# EAGLE schematic RADAR (EAGLE 7.4.0), part 2 of 2
## Sheet 3 of 3: RF
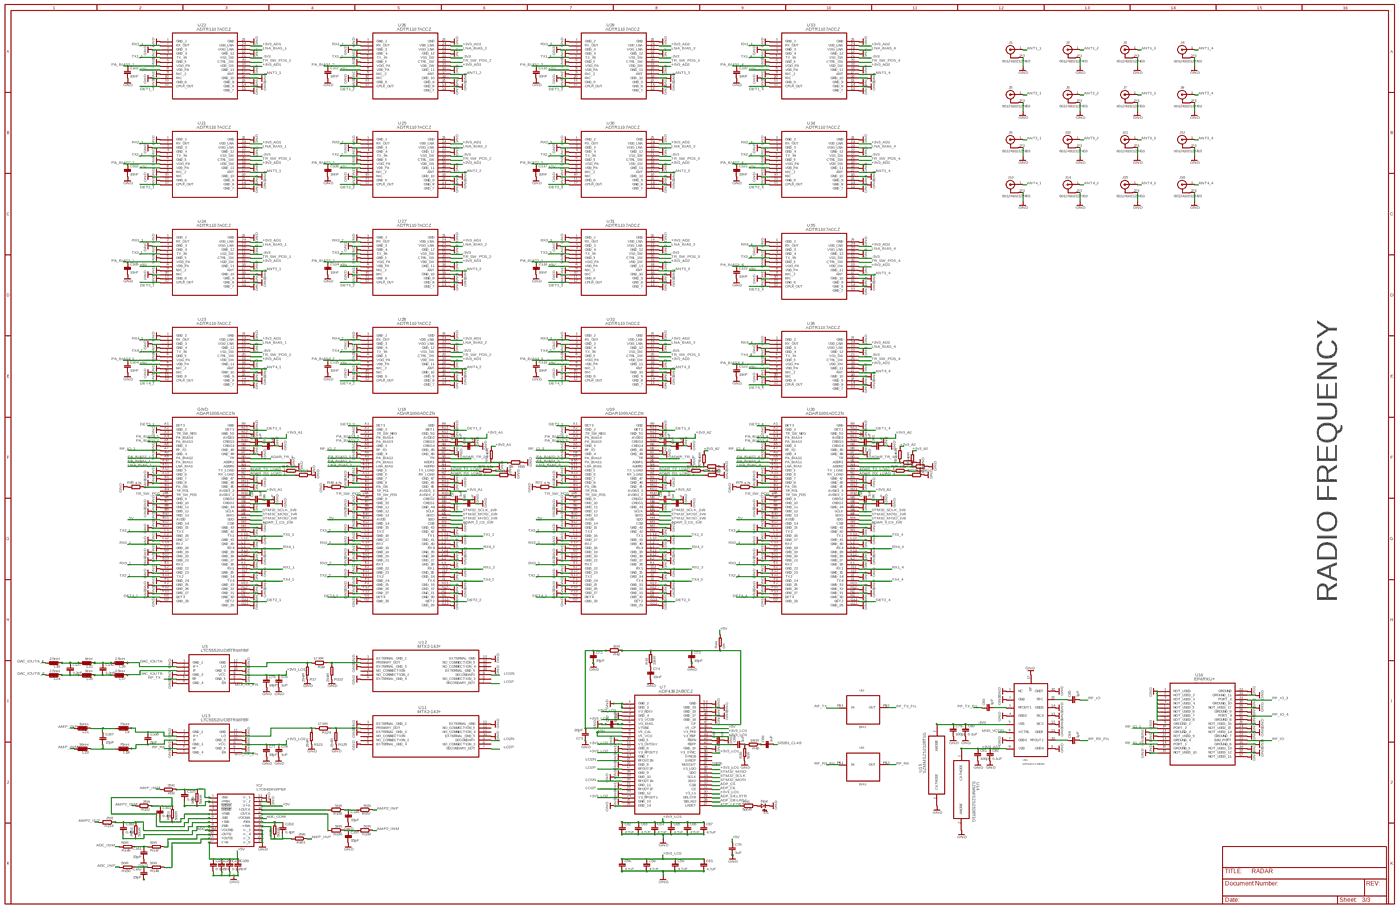
[diagram p6: schematic, sheet 3, overview]
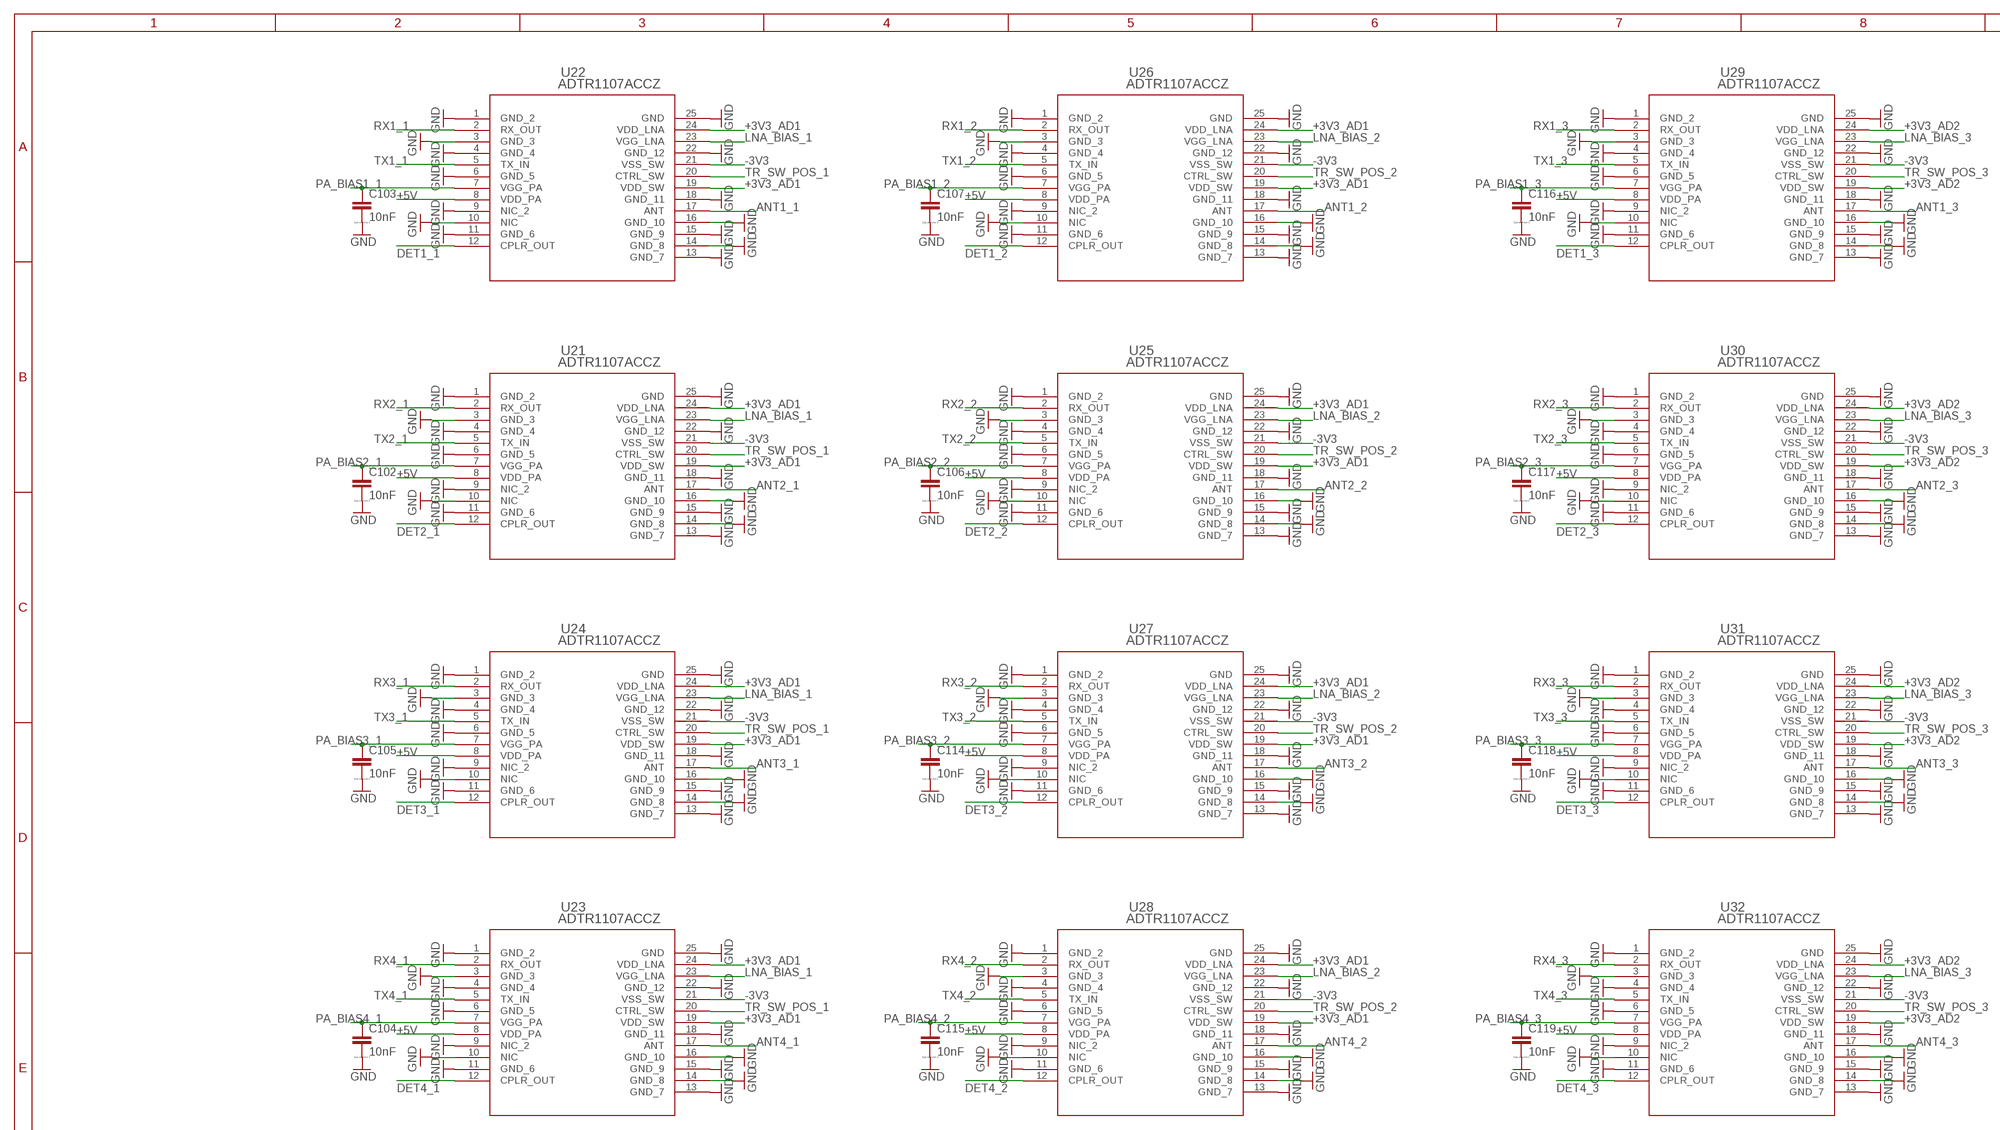
[diagram p7: schematic, sheet 3, part 1 of 4]
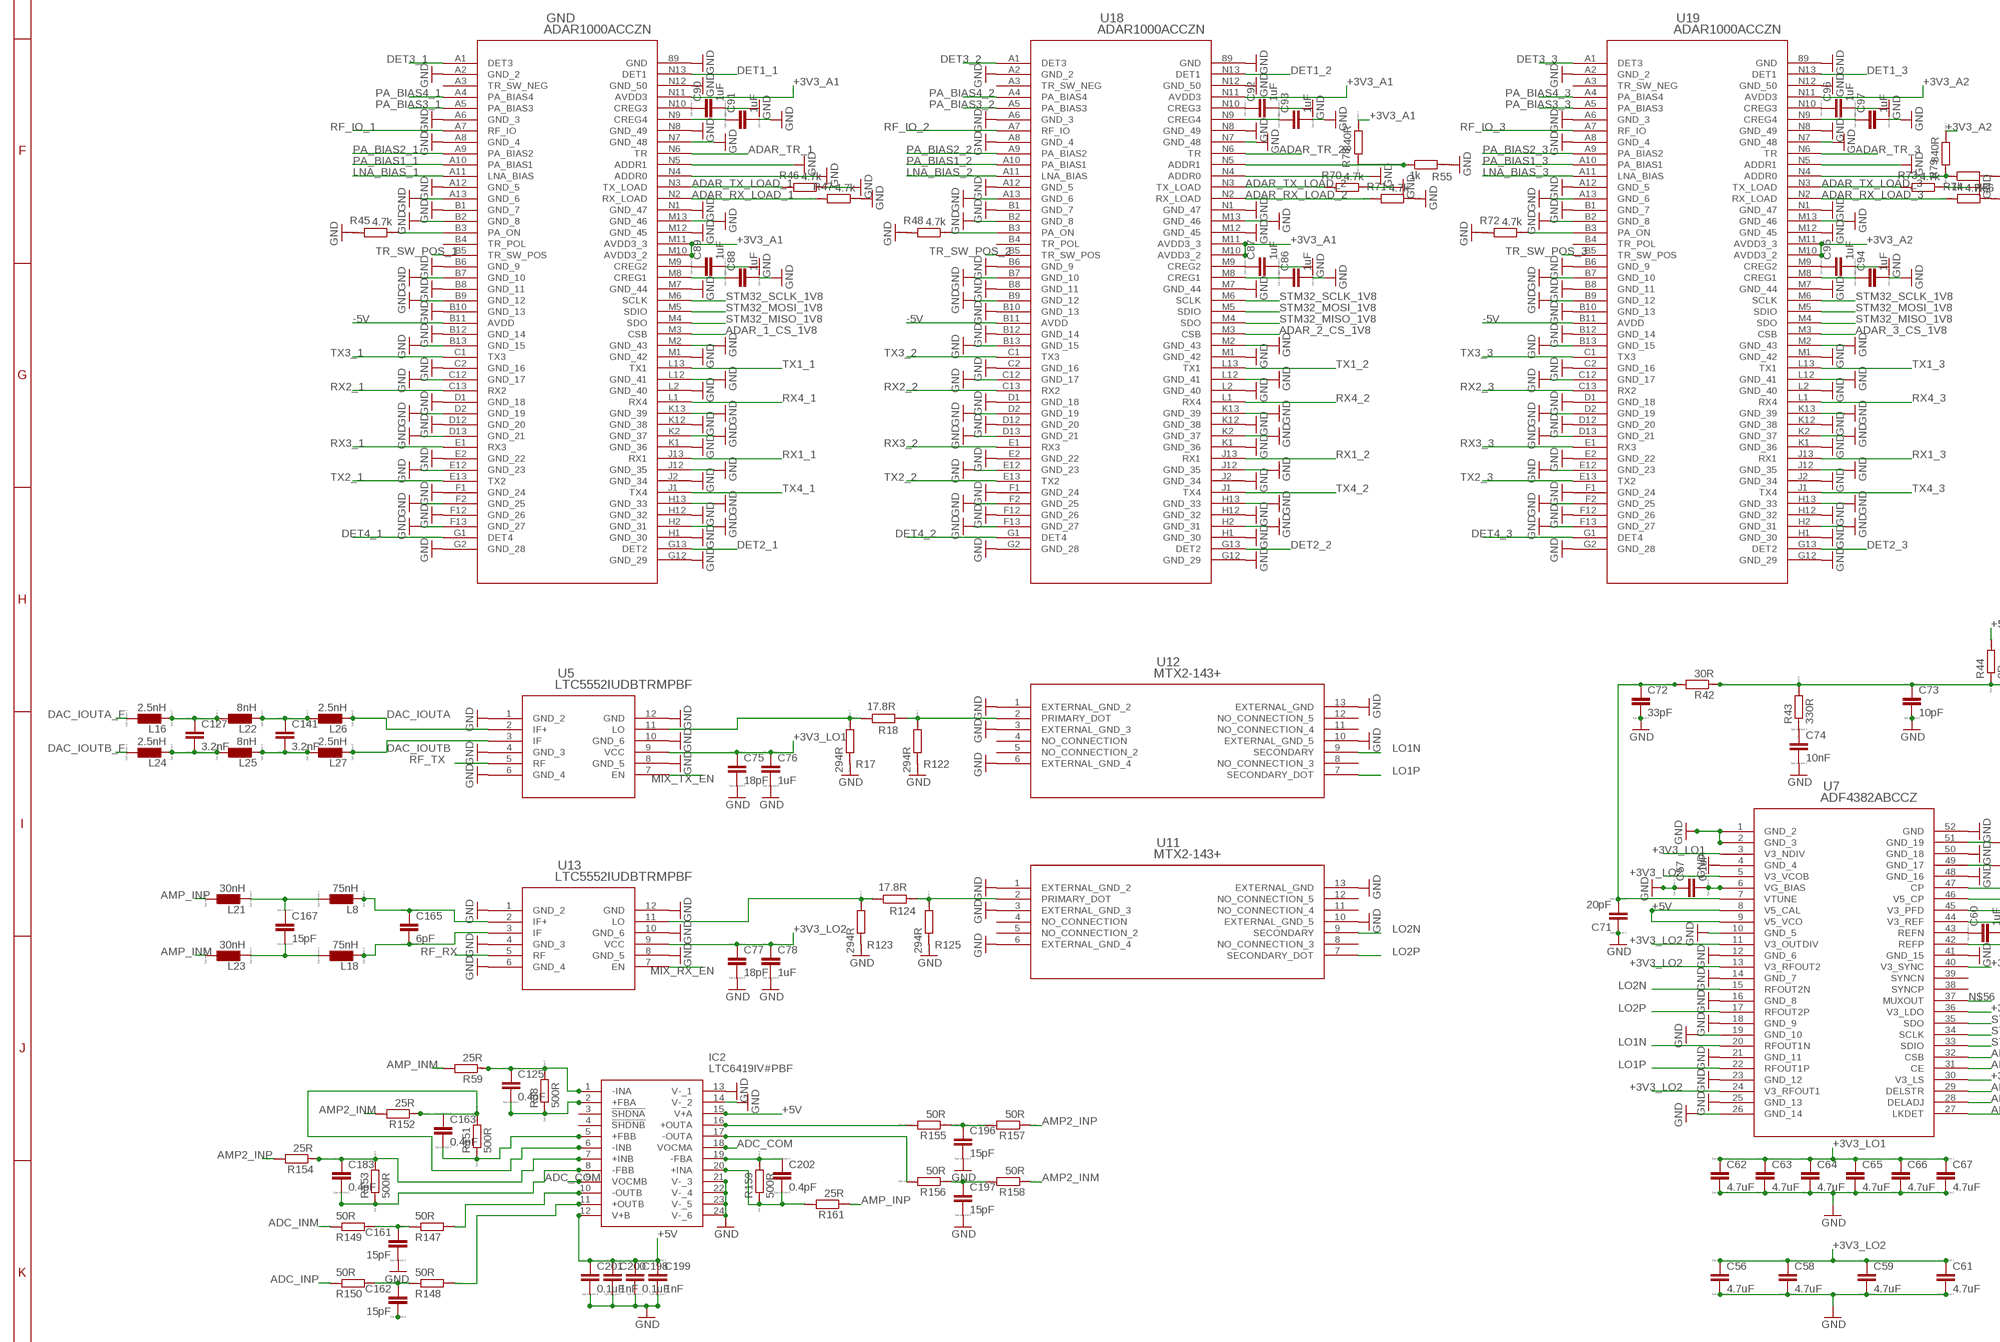
[diagram p8: schematic, sheet 3, part 2 of 4]
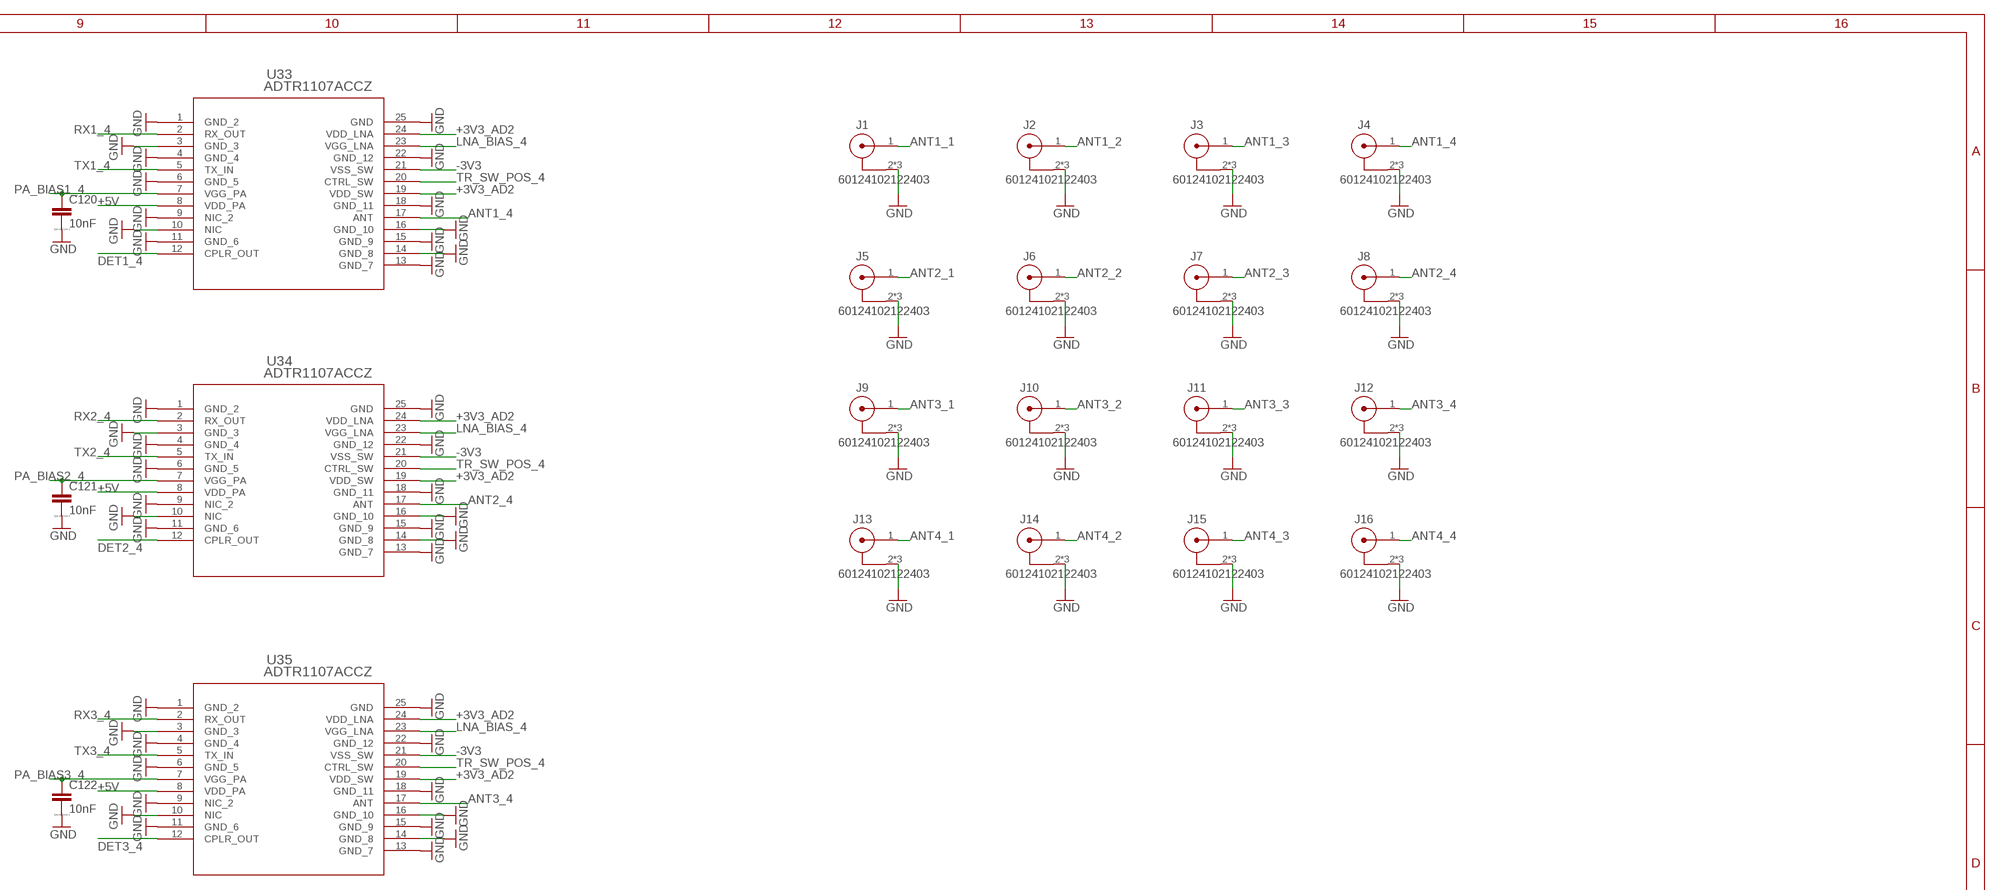
[diagram p9: schematic, sheet 3, part 3 of 4]
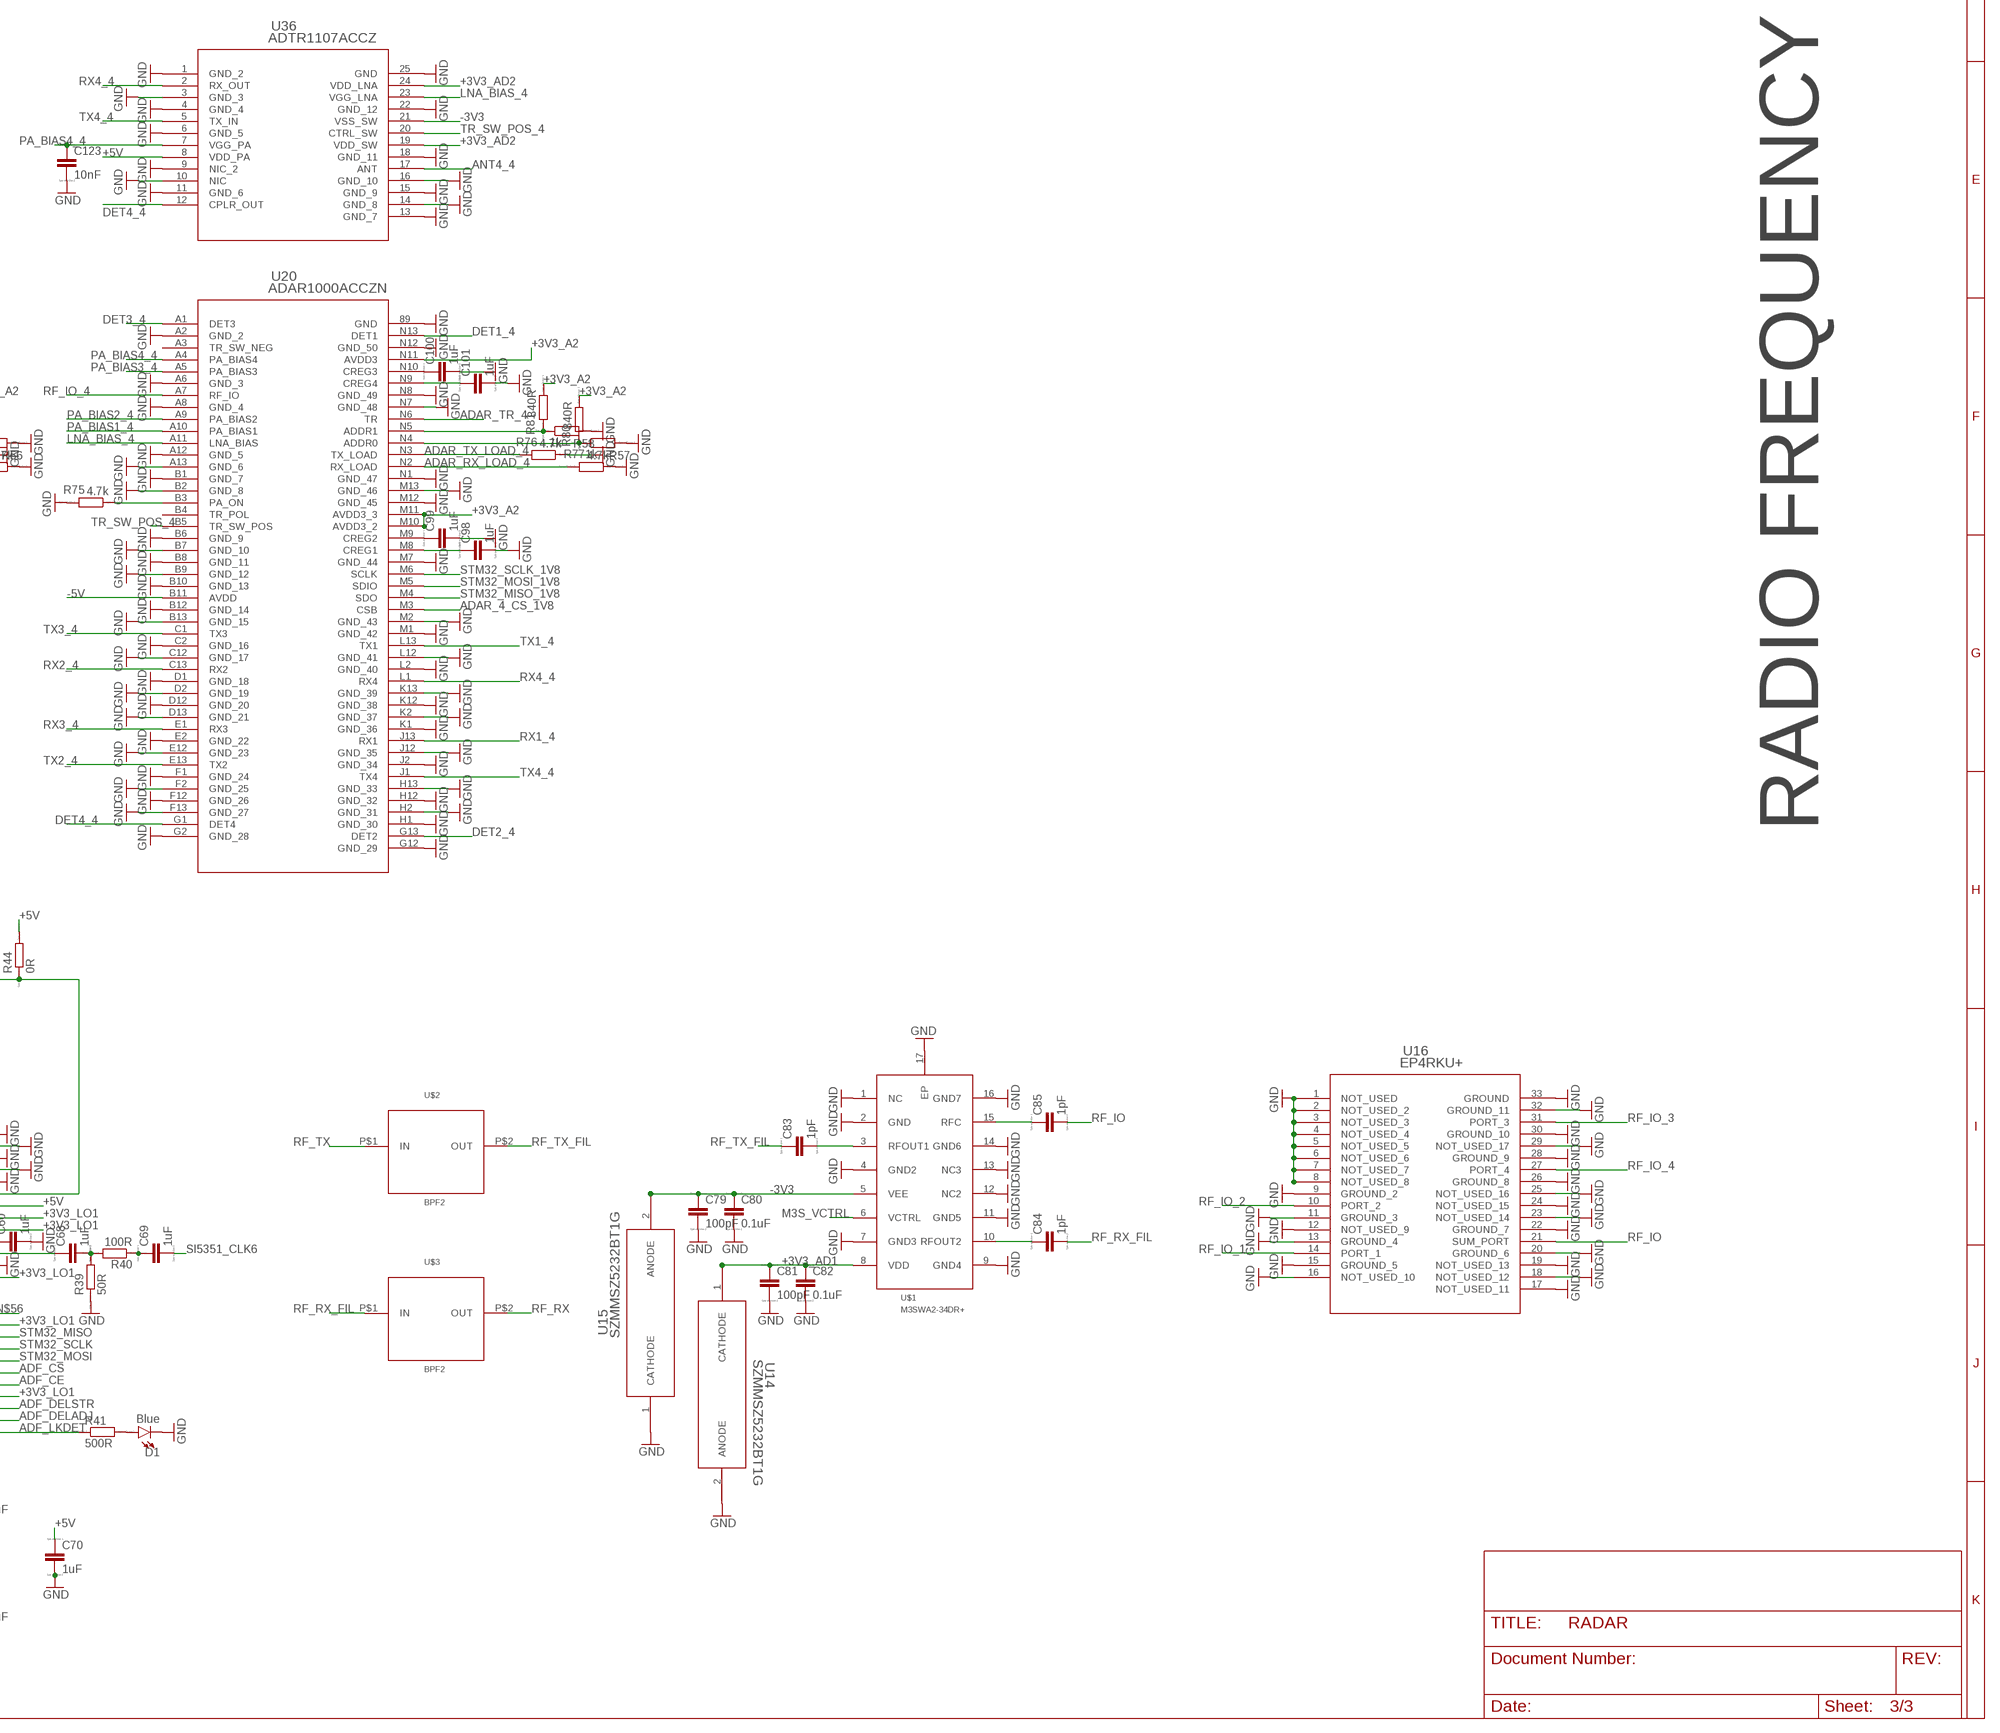
[diagram p10: schematic, sheet 3, part 4 of 4]

### Parts
C56  4.7uF  CC0201  [C0201]
C57  0.1uF  CC0201  [C0201]
C58  4.7uF  CC0201  [C0201]
C59  4.7uF  CC0201  [C0201]
C60  1uF  CC0201  [C0201]
C61  4.7uF  CC0201  [C0201]
C62  4.7uF  CC0201  [C0201]
C63  4.7uF  CC0201  [C0201]
C64  4.7uF  CC0201  [C0201]
C65  4.7uF  CC0201  [C0201]
C66  4.7uF  CC0201  [C0201]
C67  4.7uF  CC0201  [C0201]
C68  1uF  CC0201  [C0201]
C69  1uF  CC0201  [C0201]
C70  1uF  CC0201  [C0201]
C71  20pF  CC0201  [C0201]
C72  33pF  CC0201  [C0201]
C73  10pF  CC0201  [C0201]
C74  10nF  CC0201  [C0201]
C75  18pF  CC0201  [C0201]
C76  1uF  CC0201  [C0201]
C77  18pF  CC0201  [C0201]
C78  1uF  CC0201  [C0201]
C79  100pF  CC0201  [C0201]
C80  0.1uF  CC0201  [C0201]
C81  100pF  CC0201  [C0201]
C82  0.1uF  CC0201  [C0201]
C83  1pF  CC0201  [C0201]
C84  1pF  CC0201  [C0201]
C85  1pF  CC0201  [C0201]
C86  1uF  CC0201  [C0201]
C87  1uF  CC0201  [C0201]
C88  1uF  CC0201  [C0201]
C89  1uF  CC0201  [C0201]
C90  1uF  CC0201  [C0201]
C91  1uF  CC0201  [C0201]
C92  1uF  CC0201  [C0201]
C93  1uF  CC0201  [C0201]
C94  1uF  CC0201  [C0201]
C95  1uF  CC0201  [C0201]
C96  1uF  CC0201  [C0201]
C97  1uF  CC0201  [C0201]
C98  1uF  CC0201  [C0201]
C99  1uF  CC0201  [C0201]
C100  1uF  CC0201  [C0201]
C101  1uF  CC0201  [C0201]
C102  10nF  CC0201  [C0201]
C103  10nF  CC0201  [C0201]
C104  10nF  CC0201  [C0201]
C105  10nF  CC0201  [C0201]
C106  10nF  CC0201  [C0201]
C107  10nF  CC0201  [C0201]
C114  10nF  CC0201  [C0201]
C115  10nF  CC0201  [C0201]
C116  10nF  CC0201  [C0201]
C117  10nF  CC0201  [C0201]
C118  10nF  CC0201  [C0201]
C119  10nF  CC0201  [C0201]
C120  10nF  CC0201  [C0201]
C121  10nF  CC0201  [C0201]
C122  10nF  CC0201  [C0201]
C123  10nF  CC0201  [C0201]
C125  0.4pF  CC0201  [C0201]
C127  3.2nF  CC0201  [C0201]
C141  3.2nF  CC0201  [C0201]
C161  15pF  CC0201  [C0201]
C162  15pF  CC0201  [C0201]
C163  0.4pF  CC0201  [C0201]
C165  6pF  CC0201  [C0201]
C167  15pF  CC0201  [C0201]
C183  0.4pF  CC0201  [C0201]
C196  15pF  CC0201  [C0201]
C197  15pF  CC0201  [C0201]
C198  0.1uF  CC0201  [C0201]
C199  1nF  CC0201  [C0201]
C200  1nF  CC0201  [C0201]
C201  0.1uF  CC0201  [C0201]
C202  0.4pF  CC0201  [C0201]
D1  Blue  LED-BLUE0603  [LED-0603]
GND  ADAR1000ACCZN  [CC-88-1_ADI]
IC2  LTC6419IV#PBF  [LTC6419IVPBF]
J1  60124102122403  [60124102122403]
J2  60124102122403  [60124102122403]
J3  60124102122403  [60124102122403]
J4  60124102122403  [60124102122403]
J5  60124102122403  [60124102122403]
J6  60124102122403  [60124102122403]
J7  60124102122403  [60124102122403]
J8  60124102122403  [60124102122403]
J9  60124102122403  [60124102122403]
J10  60124102122403  [60124102122403]
J11  60124102122403  [60124102122403]
J12  60124102122403  [60124102122403]
J13  60124102122403  [60124102122403]
J14  60124102122403  [60124102122403]
J15  60124102122403  [60124102122403]
J16  60124102122403  [60124102122403]
L8  75nH  LL0201  [L0201]
L16  2.5nH  LL0201  [L0201]
L18  75nH  LL0201  [L0201]
L21  30nH  LL0201  [L0201]
L22  8nH  LL0201  [L0201]
L23  30nH  LL0201  [L0201]
L24  2.5nH  LL0201  [L0201]
L25  8nH  LL0201  [L0201]
L26  2.5nH  LL0201  [L0201]
L27  2.5nH  LL0201  [L0201]
R17  294R  RR0201  [R0201]
R18  17.8R  RR0201  [R0201]
R38  500R  RR0201  [R0201]
R39  50R  RR0201  [R0201]
R40  100R  RR0201  [R0201]
R41  500R  RR0201  [R0201]
R42  30R  RR0201  [R0201]
R43  330R  RR0201  [R0201]
R44  0R  RR0201  [R0201]
R45  4.7k  RR0201  [R0201]
R46  4.7k  RR0201  [R0201]
R47  4.7k  RR0201  [R0201]
R48  4.7k  RR0201  [R0201]
R55  1k  RR0201  [R0201]
R56  1k  RR0201  [R0201]
R57  1k  RR0201  [R0201]
R58  1k  RR0201  [R0201]
R59  25R  RR0201  [R0201]
R70  4.7k  RR0201  [R0201]
R71  4.7k  RR0201  [R0201]
R72  4.7k  RR0201  [R0201]
R73  4.7k  RR0201  [R0201]
R74  4.7k  RR0201  [R0201]
R75  4.7k  RR0201  [R0201]
R76  4.7k  RR0201  [R0201]
R77  4.7k  RR0201  [R0201]
R78  840R  RR0201  [R0201]
R79  840R  RR0201  [R0201]
R80  840R  RR0201  [R0201]
R81  840R  RR0201  [R0201]
R122  294R  RR0201  [R0201]
R123  294R  RR0201  [R0201]
R124  17.8R  RR0201  [R0201]
R125  294R  RR0201  [R0201]
R147  50R  RR0201  [R0201]
R148  50R  RR0201  [R0201]
R149  50R  RR0201  [R0201]
R150  50R  RR0201  [R0201]
R151  500R  RR0201  [R0201]
R152  25R  RR0201  [R0201]
R153  500R  RR0201  [R0201]
R154  25R  RR0201  [R0201]
R155  50R  RR0201  [R0201]
R156  50R  RR0201  [R0201]
R157  50R  RR0201  [R0201]
R158  50R  RR0201  [R0201]
R159  500R  RR0201  [R0201]
R161  25R  RR0201  [R0201]
U5  LTC5552IUDBTRMPBF  [UDB_12_ADI]
U7  ADF4382ABCCZ  [CC-48-10_ADI]
U11  MTX2-143+  [DQ1225_MNC]
U12  MTX2-143+  [DQ1225_MNC]
U13  LTC5552IUDBTRMPBF  [UDB_12_ADI]
U14  SZMMSZ5232BT1G  [SOD-123_ONS]
U15  SZMMSZ5232BT1G  [SOD-123_ONS]
U16  EP4RKU+  [DG1677-2_MNC]
U18  ADAR1000ACCZN  [CC-88-1_ADI]
U19  ADAR1000ACCZN  [CC-88-1_ADI]
U20  ADAR1000ACCZN  [CC-88-1_ADI]
U21  ADTR1107ACCZ  [CC-24-8_ADI]
U22  ADTR1107ACCZ  [CC-24-8_ADI]
U23  ADTR1107ACCZ  [CC-24-8_ADI]
U24  ADTR1107ACCZ  [CC-24-8_ADI]
U25  ADTR1107ACCZ  [CC-24-8_ADI]
U26  ADTR1107ACCZ  [CC-24-8_ADI]
U27  ADTR1107ACCZ  [CC-24-8_ADI]
U28  ADTR1107ACCZ  [CC-24-8_ADI]
U29  ADTR1107ACCZ  [CC-24-8_ADI]
U30  ADTR1107ACCZ  [CC-24-8_ADI]
U31  ADTR1107ACCZ  [CC-24-8_ADI]
U32  ADTR1107ACCZ  [CC-24-8_ADI]
U33  ADTR1107ACCZ  [CC-24-8_ADI]
U34  ADTR1107ACCZ  [CC-24-8_ADI]
U35  ADTR1107ACCZ  [CC-24-8_ADI]
U36  ADTR1107ACCZ  [CC-24-8_ADI]
U$1  M3SWA2-34DR+  [16_QFN]
U$2  BPF2  [BPF2]
U$3  BPF2  [BPF2]

### Nets
+3V3_A1: GND.M10(AVDD3_2) GND.M11(AVDD3_3) GND.N11(AVDD3) R78.1 U18.M10(AVDD3_2) U18.M11(AVDD3_3) U18.N11(AVDD3) ; also sheet 1
+3V3_A2: R79.1 R80.1 R81.1 U19.M10(AVDD3_2) U19.M11(AVDD3_3) U19.N11(AVDD3) U20.M10(AVDD3_2) U20.M11(AVDD3_3) U20.N11(AVDD3) ; also sheet 1
+3V3_AD1: C81.1 C82.1 U14.1(CATHODE) U21.19(VDD_SW) U21.24(VDD_LNA) U22.19(VDD_SW) U22.24(VDD_LNA) U23.19(VDD_SW) U23.24(VDD_LNA) U24.19(VDD_SW) U24.24(VDD_LNA) U25.19(VDD_SW) U25.24(VDD_LNA) U26.19(VDD_SW) U26.24(VDD_LNA) U27.19(VDD_SW) U27.24(VDD_LNA) U28.19(VDD_SW) U28.24(VDD_LNA) U$1.8(VDD) ; also sheet 1
+3V3_AD2: U29.19(VDD_SW) U29.24(VDD_LNA) U30.19(VDD_SW) U30.24(VDD_LNA) U31.19(VDD_SW) U31.24(VDD_LNA) U32.19(VDD_SW) U32.24(VDD_LNA) U33.19(VDD_SW) U33.24(VDD_LNA) U34.19(VDD_SW) U34.24(VDD_LNA) U35.19(VDD_SW) U35.24(VDD_LNA) U36.19(VDD_SW) U36.24(VDD_LNA) ; also sheet 1
+3V3_LO1: C62.1 C63.1 C64.1 C65.1 C66.1 C67.1 C75.1 C76.1 U5.9(VCC) U7.3(V3_NDIV) U7.30(V3_LS) U7.36(V3_LDO) U7.40(V3_SYNC) U7.44(V3_REF) U7.45(V3_PFD) ; also sheet 1
+3V3_LO2: C56.1 C58.1 C59.1 C61.1 C77.1 C78.1 U7.5(V3_VCOB) U7.11(V3_OUTDIV) U7.13(V3_RFOUT2) U7.24(V3_RFOUT1) U13.9(VCC) ; also sheet 1
+5V: C70.1 C198.1 C199.1 C200.1 C201.1 IC2.12(V+B) IC2.15(V+A) R44.2 U7.8(V5_CAL) U7.9(V5_VCO) U7.46(V5_CP) U21.8(VDD_PA) U22.8(VDD_PA) U23.8(VDD_PA) U24.8(VDD_PA) U25.8(VDD_PA) U26.8(VDD_PA) U27.8(VDD_PA) U28.8(VDD_PA) U29.8(VDD_PA) U30.8(VDD_PA) U31.8(VDD_PA) U32.8(VDD_PA) U33.8(VDD_PA) U34.8(VDD_PA) U35.8(VDD_PA) U36.8(VDD_PA) ; also sheet 1,2
-3V3: C79.1 C80.1 U15.2(ANODE) U21.21(VSS_SW) U22.21(VSS_SW) U23.21(VSS_SW) U24.21(VSS_SW) U25.21(VSS_SW) U26.21(VSS_SW) U27.21(VSS_SW) U28.21(VSS_SW) U29.21(VSS_SW) U30.21(VSS_SW) U31.21(VSS_SW) U32.21(VSS_SW) U33.21(VSS_SW) U34.21(VSS_SW) U35.21(VSS_SW) U36.21(VSS_SW) U$1.5(VEE) ; also sheet 1
-5V: GND.B11(AVDD) U18.B11(AVDD) U19.B11(AVDD) U20.B11(AVDD) ; also sheet 1
ADAR_1_CS_1V8: GND.M3(CSB) ; also sheet 2
ADAR_2_CS_1V8: U18.M3(CSB) ; also sheet 2
ADAR_3_CS_1V8: U19.M3(CSB) ; also sheet 2
ADAR_4_CS_1V8: U20.M3(CSB) ; also sheet 2
ADAR_RX_LOAD_1: GND.N2(RX_LOAD) R47.2 ; also sheet 2
ADAR_RX_LOAD_2: R71.2 U18.N2(RX_LOAD) ; also sheet 2
ADAR_RX_LOAD_3: R74.2 U19.N2(RX_LOAD) ; also sheet 2
ADAR_RX_LOAD_4: R77.2 U20.N2(RX_LOAD) ; also sheet 2
ADAR_TR_1: GND.N6(TR) ; also sheet 2
ADAR_TR_2: U18.N6(TR) ; also sheet 2
ADAR_TR_3: U19.N6(TR) ; also sheet 2
ADAR_TR_4: U20.N6(TR) ; also sheet 2
ADAR_TX_LOAD_1: GND.N3(TX_LOAD) R46.2 ; also sheet 2
ADAR_TX_LOAD_2: R70.2 U18.N3(TX_LOAD) ; also sheet 2
ADAR_TX_LOAD_3: R73.2 U19.N3(TX_LOAD) ; also sheet 2
ADAR_TX_LOAD_4: R76.2 U20.N3(TX_LOAD) ; also sheet 2
ADC_COM: IC2.9(VOCMB) IC2.18(VOCMA) ; also sheet 2
ADC_INM: R149.1 ; also sheet 2
ADC_INP: R150.1 ; also sheet 2
ADF_CE: U7.31(CE) ; also sheet 2
ADF_CS: U7.32(CSB) ; also sheet 2
ADF_DELADJ: U7.28(DELADJ) ; also sheet 2
ADF_DELSTR: U7.29(DELSTR) ; also sheet 2
ADF_LKDET: R41.1 U7.27(LKDET)
AMP2_INM: R152.2 R158.1
AMP2_INP: R154.2 R157.1
AMP_INM: L23.1 R59.2
AMP_INP: L21.1 R161.1
ANT1_1: J1.1 U22.17(ANT)
ANT1_2: J2.1 U26.17(ANT)
ANT1_3: J3.1 U29.17(ANT)
ANT1_4: J4.1 U33.17(ANT)
ANT2_1: J5.1 U21.17(ANT)
ANT2_2: J6.1 U25.17(ANT)
ANT2_3: J7.1 U30.17(ANT)
ANT2_4: J8.1 U34.17(ANT)
ANT3_1: J9.1 U24.17(ANT)
ANT3_2: J10.1 U27.17(ANT)
ANT3_3: J11.1 U31.17(ANT)
ANT3_4: J12.1 U35.17(ANT)
ANT4_1: J13.1 U23.17(ANT)
ANT4_2: J14.1 U28.17(ANT)
ANT4_3: J15.1 U32.17(ANT)
ANT4_4: J16.1 U36.17(ANT)
DAC_IOUTA: L26.2 U5.2(IF+)
DAC_IOUTA_F: L16.1 ; also sheet 2
DAC_IOUTB: L27.2 U5.3(IF)
DAC_IOUTB_F: L24.1 ; also sheet 2
DET1_1: GND.N13(DET1) U22.12(CPLR_OUT)
DET1_2: U18.N13(DET1) U26.12(CPLR_OUT)
DET1_3: U19.N13(DET1) U29.12(CPLR_OUT)
DET1_4: U20.N13(DET1) U33.12(CPLR_OUT)
DET2_1: GND.G13(DET2) U21.12(CPLR_OUT)
DET2_2: U18.G13(DET2) U25.12(CPLR_OUT)
DET2_3: U19.G13(DET2) U30.12(CPLR_OUT)
DET2_4: U20.G13(DET2) U34.12(CPLR_OUT)
DET3_1: GND.A1(DET3) U24.12(CPLR_OUT)
DET3_2: U18.A1(DET3) U27.12(CPLR_OUT)
DET3_3: U19.A1(DET3) U31.12(CPLR_OUT)
DET3_4: U20.A1(DET3) U35.12(CPLR_OUT)
DET4_1: GND.G1(DET4) U23.12(CPLR_OUT)
DET4_2: U18.G1(DET4) U28.12(CPLR_OUT)
DET4_3: U19.G1(DET4) U32.12(CPLR_OUT)
DET4_4: U20.G1(DET4) U36.12(CPLR_OUT)
GND: C56.2 C57.1 C58.2 C59.2 C60.2 C61.2 C62.2 C63.2 C64.2 C65.2 C66.2 C67.2 C70.2 C71.1 C72.2 C73.2 C74.2 C75.2 C76.2 C77.2 C78.2 C79.2 C80.2 C81.2 C82.2 C86.2 C87.2 C88.2 C89.2 C90.2 C91.2 C92.2 C93.2 C94.2 C95.2 C96.2 C97.2 C98.2 C99.2 C100.2 C101.2 C102.2 C103.2 C104.2 C105.2 C106.2 C107.2 C114.2 C115.2 C116.2 C117.2 C118.2 C119.2 C120.2 C121.2 C122.2 C123.2 C161.2 C162.2 C196.2 C197.2 C198.2 C199.2 C200.2 C201.2 D1.C GND.89(GND) GND.A2(GND_2) GND.A6(GND_3) GND.A8(GND_4) GND.A12(GND_5) GND.A13(GND_6) GND.B1(GND_7) GND.B2(GND_8) GND.B6(GND_9) GND.B7(GND_10) GND.B8(GND_11) GND.B9(GND_12) GND.B10(GND_13) GND.B12(GND_14) GND.B13(GND_15) GND.C2(GND_16) GND.C12(GND_17) GND.D1(GND_18) GND.D2(GND_19) GND.D12(GND_20) GND.D13(GND_21) GND.E2(GND_22) GND.E12(GND_23) GND.F1(GND_24) GND.F2(GND_25) GND.F12(GND_26) GND.F13(GND_27) GND.G2(GND_28) GND.G12(GND_29) GND.H1(GND_30) GND.H2(GND_31) GND.H12(GND_32) GND.H13(GND_33) GND.J2(GND_34) GND.J12(GND_35) GND.K1(GND_36) GND.K2(GND_37) GND.K12(GND_38) GND.K13(GND_39) GND.L2(GND_40) GND.L12(GND_41) GND.M1(GND_42) GND.M2(GND_43) GND.M7(GND_44) GND.M12(GND_45) GND.M13(GND_46) GND.N1(GND_47) GND.N4(ADDR0) GND.N5(ADDR1) GND.N7(GND_48) GND.N8(GND_49) GND.N12(GND_50) IC2.13(V-_1) IC2.14(V-_2) IC2.21(V-_3) IC2.22(V-_4) IC2.23(V-_5) IC2.24(V-_6) J1.2 J1.3 J1.4 J2.2 J2.3 J2.4 J3.2 J3.3 J3.4 J4.2 J4.3 J4.4 J5.2 J5.3 J5.4 J6.2 J6.3 J6.4 J7.2 J7.3 J7.4 J8.2 J8.3 J8.4 J9.2 J9.3 J9.4 J10.2 J10.3 J10.4 J11.2 J11.3 J11.4 J12.2 J12.3 J12.4 J13.2 J13.3 J13.4 J14.2 J14.3 J14.4 J15.2 J15.3 J15.4 J16.2 J16.3 J16.4 R17.2 R39.1 R45.2 R46.1 R47.1 R48.2 R55.2 R56.2 R57.2 R58.2 R70.1 R71.1 R72.2 R73.1 R74.1 R75.2 R76.1 R77.1 R122.2 R123.2 R125.2 U5.1(GND_2) U5.4(GND_3) U5.6(GND_4) U5.8(GND_5) U5.10(GND_6) U5.12(GND) U7.1(GND_2) U7.2(GND_3) U7.4(GND_4) U7.10(GND_5) U7.12(GND_6) U7.14(GND_7) U7.16(GND_8) U7.18(GND_9) U7.19(GND_10) U7.21(GND_11) U7.23(GND_12) U7.25(GND_13) U7.26(GND_14) U7.41(GND_15) U7.48(GND_16) U7.49(GND_17) U7.50(GND_18) U7.51(GND_19) U7.52(GND) U11.1(EXTERNAL_GND_2) U11.3(EXTERNAL_GND_3) U11.6(EXTERNAL_GND_4) U11.10(EXTERNAL_GND_5) U11.13(EXTERNAL_GND) U12.1(EXTERNAL_GND_2) U12.3(EXTERNAL_GND_3) U12.6(EXTERNAL_GND_4) U12.10(EXTERNAL_GND_5) U12.13(EXTERNAL_GND) U13.1(GND_2) U13.4(GND_3) U13.6(GND_4) U13.8(GND_5) U13.10(GND_6) U13.12(GND) U14.2(ANODE) U15.1(CATHODE) U16.1(NOT_USED) U16.2(NOT_USED_2) U16.3(NOT_USED_3) U16.4(NOT_USED_4) U16.5(NOT_USED_5) U16.6(NOT_USED_6) U16.7(NOT_USED_7) U16.8(NOT_USED_8) U16.9(GROUND_2) U16.11(GROUND_3) U16.12(NOT_USED_9) U16.13(GROUND_4) U16.15(GROUND_5) U16.16(NOT_USED_10) U16.17(NOT_USED_11) U16.18(NOT_USED_12) U16.19(NOT_USED_13) U16.20(GROUND_6) U16.22(GROUND_7) U16.23(NOT_USED_14) U16.24(NOT_USED_15) U16.25(NOT_USED_16) U16.26(GROUND_8) U16.28(GROUND_9) U16.29(NOT_USED_17) U16.30(GROUND_10) U16.32(GROUND_11) U16.33(GROUND) U18.89(GND) U18.A2(GND_2) U18.A6(GND_3) U18.A8(GND_4) U18.A12(GND_5) U18.A13(GND_6) U18.B1(GND_7) U18.B2(GND_8) U18.B6(GND_9) U18.B7(GND_10) U18.B8(GND_11) U18.B9(GND_12) U18.B10(GND_13) U18.B12(GND_14) U18.B13(GND_15) U18.C2(GND_16) U18.C12(GND_17) U18.D1(GND_18) U18.D2(GND_19) U18.D12(GND_20) U18.D13(GND_21) U18.E2(GND_22) U18.E12(GND_23) U18.F1(GND_24) U18.F2(GND_25) U18.F12(GND_26) U18.F13(GND_27) U18.G2(GND_28) U18.G12(GND_29) U18.H1(GND_30) U18.H2(GND_31) U18.H12(GND_32) U18.H13(GND_33) U18.J2(GND_34) U18.J12(GND_35) U18.K1(GND_36) U18.K2(GND_37) U18.K12(GND_38) U18.K13(GND_39) U18.L2(GND_40) U18.L12(GND_41) U18.M1(GND_42) U18.M2(GND_43) U18.M7(GND_44) U18.M12(GND_45) U18.M13(GND_46) U18.N1(GND_47) U18.N4(ADDR0) U18.N7(GND_48) U18.N8(GND_49) U18.N12(GND_50) U19.89(GND) U19.A2(GND_2) U19.A6(GND_3) U19.A8(GND_4) U19.A12(GND_5) U19.A13(GND_6) U19.B1(GND_7) U19.B2(GND_8) U19.B6(GND_9) U19.B7(GND_10) U19.B8(GND_11) U19.B9(GND_12) U19.B10(GND_13) U19.B12(GND_14) U19.B13(GND_15) U19.C2(GND_16) U19.C12(GND_17) U19.D1(GND_18) U19.D2(GND_19) U19.D12(GND_20) U19.D13(GND_21) U19.E2(GND_22) U19.E12(GND_23) U19.F1(GND_24) U19.F2(GND_25) U19.F12(GND_26) U19.F13(GND_27) U19.G2(GND_28) U19.G12(GND_29) U19.H1(GND_30) U19.H2(GND_31) U19.H12(GND_32) U19.H13(GND_33) U19.J2(GND_34) U19.J12(GND_35) U19.K1(GND_36) U19.K2(GND_37) U19.K12(GND_38) U19.K13(GND_39) U19.L2(GND_40) U19.L12(GND_41) U19.M1(GND_42) U19.M2(GND_43) U19.M7(GND_44) U19.M12(GND_45) U19.M13(GND_46) U19.N1(GND_47) U19.N5(ADDR1) U19.N7(GND_48) U19.N8(GND_49) U19.N12(GND_50) U20.89(GND) U20.A2(GND_2) U20.A6(GND_3) U20.A8(GND_4) U20.A12(GND_5) U20.A13(GND_6) U20.B1(GND_7) U20.B2(GND_8) U20.B6(GND_9) U20.B7(GND_10) U20.B8(GND_11) U20.B9(GND_12) U20.B10(GND_13) U20.B12(GND_14) U20.B13(GND_15) U20.C2(GND_16) U20.C12(GND_17) U20.D1(GND_18) U20.D2(GND_19) U20.D12(GND_20) U20.D13(GND_21) U20.E2(GND_22) U20.E12(GND_23) U20.F1(GND_24) U20.F2(GND_25) U20.F12(GND_26) U20.F13(GND_27) U20.G2(GND_28) U20.G12(GND_29) U20.H1(GND_30) U20.H2(GND_31) U20.H12(GND_32) U20.H13(GND_33) U20.J2(GND_34) U20.J12(GND_35) U20.K1(GND_36) U20.K2(GND_37) U20.K12(GND_38) U20.K13(GND_39) U20.L2(GND_40) U20.L12(GND_41) U20.M1(GND_42) U20.M2(GND_43) U20.M7(GND_44) U20.M12(GND_45) U20.M13(GND_46) U20.N1(GND_47) U20.N7(GND_48) U20.N8(GND_49) U20.N12(GND_50) U21.1(GND_2) U21.3(GND_3) U21.4(GND_4) U21.6(GND_5) U21.9(NIC_2) U21.10(NIC) U21.11(GND_6) U21.13(GND_7) U21.14(GND_8) U21.15(GND_9) U21.16(GND_10) U21.18(GND_11) U21.22(GND_12) U21.25(GND) U22.1(GND_2) U22.3(GND_3) U22.4(GND_4) U22.6(GND_5) U22.9(NIC_2) U22.10(NIC) U22.11(GND_6) U22.13(GND_7) U22.14(GND_8) U22.15(GND_9) U22.16(GND_10) U22.18(GND_11) U22.22(GND_12) U22.25(GND) U23.1(GND_2) U23.3(GND_3) U23.4(GND_4) U23.6(GND_5) U23.9(NIC_2) U23.10(NIC) U23.11(GND_6) U23.13(GND_7) U23.14(GND_8) U23.15(GND_9) U23.16(GND_10) U23.18(GND_11) U23.22(GND_12) U23.25(GND) U24.1(GND_2) U24.3(GND_3) U24.4(GND_4) U24.6(GND_5) U24.9(NIC_2) U24.10(NIC) U24.11(GND_6) U24.13(GND_7) U24.14(GND_8) U24.15(GND_9) U24.16(GND_10) U24.18(GND_11) U24.22(GND_12) U24.25(GND) U25.1(GND_2) U25.3(GND_3) U25.4(GND_4) U25.6(GND_5) U25.9(NIC_2) U25.10(NIC) U25.11(GND_6) U25.13(GND_7) U25.14(GND_8) U25.15(GND_9) U25.16(GND_10) U25.18(GND_11) U25.22(GND_12) U25.25(GND) U26.1(GND_2) U26.3(GND_3) U26.4(GND_4) U26.6(GND_5) U26.9(NIC_2) U26.10(NIC) U26.11(GND_6) U26.13(GND_7) U26.14(GND_8) U26.15(GND_9) U26.16(GND_10) U26.18(GND_11) U26.22(GND_12) U26.25(GND) U27.1(GND_2) U27.3(GND_3) U27.4(GND_4) U27.6(GND_5) U27.9(NIC_2) U27.10(NIC) U27.11(GND_6) U27.13(GND_7) U27.14(GND_8) U27.15(GND_9) U27.16(GND_10) U27.18(GND_11) U27.22(GND_12) U27.25(GND) U28.1(GND_2) U28.3(GND_3) U28.4(GND_4) U28.6(GND_5) U28.9(NIC_2) U28.10(NIC) U28.11(GND_6) U28.13(GND_7) U28.14(GND_8) U28.15(GND_9) U28.16(GND_10) U28.18(GND_11) U28.22(GND_12) U28.25(GND) U29.1(GND_2) U29.3(GND_3) U29.4(GND_4) U29.6(GND_5) U29.9(NIC_2) U29.10(NIC) U29.11(GND_6) U29.13(GND_7) U29.14(GND_8) U29.15(GND_9) U29.16(GND_10) U29.18(GND_11) U29.22(GND_12) U29.25(GND) U30.1(GND_2) U30.3(GND_3) U30.4(GND_4) U30.6(GND_5) U30.9(NIC_2) U30.10(NIC) U30.11(GND_6) U30.13(GND_7) U30.14(GND_8) U30.15(GND_9) U30.16(GND_10) U30.18(GND_11) U30.22(GND_12) U30.25(GND) U31.1(GND_2) U31.3(GND_3) U31.4(GND_4) U31.6(GND_5) U31.9(NIC_2) U31.10(NIC) U31.11(GND_6) U31.13(GND_7) U31.14(GND_8) U31.15(GND_9) U31.16(GND_10) U31.18(GND_11) U31.22(GND_12) U31.25(GND) U32.1(GND_2) U32.3(GND_3) U32.4(GND_4) U32.6(GND_5) U32.9(NIC_2) U32.10(NIC) U32.11(GND_6) U32.13(GND_7) U32.14(GND_8) U32.15(GND_9) U32.16(GND_10) U32.18(GND_11) U32.22(GND_12) U32.25(GND) U33.1(GND_2) U33.3(GND_3) U33.4(GND_4) U33.6(GND_5) U33.9(NIC_2) U33.10(NIC) U33.11(GND_6) U33.13(GND_7) U33.14(GND_8) U33.15(GND_9) U33.16(GND_10) U33.18(GND_11) U33.22(GND_12) U33.25(GND) U34.1(GND_2) U34.3(GND_3) U34.4(GND_4) U34.6(GND_5) U34.9(NIC_2) U34.10(NIC) U34.11(GND_6) U34.13(GND_7) U34.14(GND_8) U34.15(GND_9) U34.16(GND_10) U34.18(GND_11) U34.22(GND_12) U34.25(GND) U35.1(GND_2) U35.3(GND_3) U35.4(GND_4) U35.6(GND_5) U35.9(NIC_2) U35.10(NIC) U35.11(GND_6) U35.13(GND_7) U35.14(GND_8) U35.15(GND_9) U35.16(GND_10) U35.18(GND_11) U35.22(GND_12) U35.25(GND) U36.1(GND_2) U36.3(GND_3) U36.4(GND_4) U36.6(GND_5) U36.9(NIC_2) U36.10(NIC) U36.11(GND_6) U36.13(GND_7) U36.14(GND_8) U36.15(GND_9) U36.16(GND_10) U36.18(GND_11) U36.22(GND_12) U36.25(GND) U$1.1(NC) U$1.2(GND) U$1.4(GND2) U$1.7(GND3) U$1.9(GND4) U$1.11(GND5) U$1.12(NC2) U$1.13(NC3) U$1.14(GND6) U$1.16(GND7) U$1.17(EP) ; also sheet 1,2
LNA_BIAS_1: GND.A11(LNA_BIAS) U21.23(VGG_LNA) U22.23(VGG_LNA) U23.23(VGG_LNA) U24.23(VGG_LNA)
LNA_BIAS_2: U18.A11(LNA_BIAS) U25.23(VGG_LNA) U26.23(VGG_LNA) U27.23(VGG_LNA) U28.23(VGG_LNA)
LNA_BIAS_3: U19.A11(LNA_BIAS) U29.23(VGG_LNA) U30.23(VGG_LNA) U31.23(VGG_LNA) U32.23(VGG_LNA)
LNA_BIAS_4: U20.A11(LNA_BIAS) U33.23(VGG_LNA) U34.23(VGG_LNA) U35.23(VGG_LNA) U36.23(VGG_LNA)
LO1N: U7.20(RFOUT1N) U12.9(SECONDARY)
LO1P: U7.22(RFOUT1P) U12.7(SECONDARY_DOT)
LO2N: U7.15(RFOUT2N) U11.9(SECONDARY)
LO2P: U7.17(RFOUT2P) U11.7(SECONDARY_DOT)
M3S_VCTRL: U$1.6(VCTRL) ; also sheet 2
MIX_RX_EN: U13.7(EN) ; also sheet 2
MIX_TX_EN: U5.7(EN) ; also sheet 2
N$17: C125.1 IC2.1(-INA) R38.2 R59.1
N$20: R17.1 R18.1 U5.11(LO)
N$21: C83.2 U$1.3(RFOUT1)
N$31: C85.1 U$1.15(RFC)
N$35: C57.2 U7.6(VG_BIAS)
N$38: C84.1 U$1.10(RFOUT2)
N$39: GND.B3(PA_ON) R45.1
N$40: R48.1 U18.B3(PA_ON)
N$41: C165.1 L8.2 U13.2(IF+)
N$42: C87.1 U18.M9(CREG2)
N$43: C73.1 R42.1 R43.2 R44.1 U7.47(CP)
N$44: C71.2 C72.1 R42.2 U7.7(VTUNE)
N$45: C86.1 U18.M8(CREG1)
N$46: C92.1 U18.N10(CREG3)
N$47: C165.2 L18.2 U13.3(IF)
N$48: C60.1 U7.43(REFN)
N$49: C68.2 R39.2 R40.2
N$50: C69.1 R40.1
N$51: C68.1 U7.42(REFP)
N$53: C93.1 U18.N9(CREG4)
N$56: U7.37(MUXOUT)
N$57: R72.1 U19.B3(PA_ON)
N$58: C167.1 L8.1 L21.2
N$59: C95.1 U19.M9(CREG2)
N$60: C94.1 U19.M8(CREG1)
N$61: C96.1 U19.N10(CREG3)
N$62: C167.2 L18.1 L23.2
N$63: C97.1 U19.N9(CREG4)
N$64: R75.1 U20.B3(PA_ON)
N$65: R18.2 R122.1 U12.2(PRIMARY_DOT)
N$66: C91.1 GND.N9(CREG4)
N$67: D1.A R41.2
N$68: C99.1 U20.M9(CREG2)
N$69: C98.1 U20.M8(CREG1)
N$70: C100.1 U20.N10(CREG3)
N$71: C74.1 R43.1
N$72: R123.1 R124.1 U13.11(LO)
N$73: R124.2 R125.1 U11.2(PRIMARY_DOT)
N$74: C127.1 L16.2 L22.1
N$75: C101.1 U20.N9(CREG4)
N$76: C89.1 GND.M9(CREG2)
N$77: C88.1 GND.M8(CREG1)
N$78: C125.2 IC2.2(+FBA) R38.1
N$79: C90.1 GND.N10(CREG3)
N$80: R55.1 R78.2 U18.N5(ADDR1)
N$81: R56.1 R79.2 U19.N4(ADDR0)
N$83: R58.1 R81.2 U20.N5(ADDR1)
N$84: R57.1 R80.2 U20.N4(ADDR0)
N$99: C141.1 L22.2 L26.1
N$100: C127.2 L24.2 L25.1
N$101: C141.2 L25.2 L27.1
N$125: C161.1 R147.1 R149.2
N$126: C162.1 R148.1 R150.2
N$127: IC2.10(-OUTB) R147.2
N$128: IC2.11(+OUTB) R148.2
N$129: C163.1 IC2.6(-INB) R151.2 R152.1
N$130: C163.2 IC2.5(+FBB) R151.1
N$131: C183.1 IC2.7(+INB) R153.2 R154.1
N$132: C183.2 IC2.8(-FBB) R153.1
N$133: IC2.16(+OUTA) R155.2
N$134: IC2.17(-OUTA) R156.2
N$135: C196.1 R155.1 R157.2
N$136: C197.1 R156.1 R158.2
N$138: C202.2 IC2.20(+INA) R159.1 R161.2
N$139: C202.1 IC2.19(-FBA) R159.2
PA_BIAS1_1: C103.1 GND.A10(PA_BIAS1) U22.7(VGG_PA)
PA_BIAS1_2: C107.1 U18.A10(PA_BIAS1) U26.7(VGG_PA)
PA_BIAS1_3: C116.1 U19.A10(PA_BIAS1) U29.7(VGG_PA)
PA_BIAS1_4: C120.1 U20.A10(PA_BIAS1) U33.7(VGG_PA)
PA_BIAS2_1: C102.1 GND.A9(PA_BIAS2) U21.7(VGG_PA)
PA_BIAS2_2: C106.1 U18.A9(PA_BIAS2) U25.7(VGG_PA)
PA_BIAS2_3: C117.1 U19.A9(PA_BIAS2) U30.7(VGG_PA)
PA_BIAS2_4: C121.1 U20.A9(PA_BIAS2) U34.7(VGG_PA)
PA_BIAS3_1: C105.1 GND.A5(PA_BIAS3) U24.7(VGG_PA)
PA_BIAS3_2: C114.1 U18.A5(PA_BIAS3) U27.7(VGG_PA)
PA_BIAS3_3: C118.1 U19.A5(PA_BIAS3) U31.7(VGG_PA)
PA_BIAS3_4: C122.1 U20.A5(PA_BIAS3) U35.7(VGG_PA)
PA_BIAS4_1: C104.1 GND.A4(PA_BIAS4) U23.7(VGG_PA)
PA_BIAS4_2: C115.1 U18.A4(PA_BIAS4) U28.7(VGG_PA)
PA_BIAS4_3: C119.1 U19.A4(PA_BIAS4) U32.7(VGG_PA)
PA_BIAS4_4: C123.1 U20.A4(PA_BIAS4) U36.7(VGG_PA)
RF_IO: C85.2 U16.21(SUM_PORT)
RF_IO_1: GND.A7(RF_IO) U16.14(PORT_1)
RF_IO_2: U16.10(PORT_2) U18.A7(RF_IO)
RF_IO_3: U16.31(PORT_3) U19.A7(RF_IO)
RF_IO_4: U16.27(PORT_4) U20.A7(RF_IO)
RF_RX: U13.5(RF) U$3.P$2(OUT)
RF_RX_FIL: C84.2 U$3.P$1(IN)
RF_TX: U5.5(RF) U$2.P$1(IN)
RF_TX_FIL: C83.1 U$2.P$2(OUT)
RX1_1: GND.J13(RX1) U22.2(RX_OUT)
RX1_2: U18.J13(RX1) U26.2(RX_OUT)
RX1_3: U19.J13(RX1) U29.2(RX_OUT)
RX1_4: U20.J13(RX1) U33.2(RX_OUT)
RX2_1: GND.C13(RX2) U21.2(RX_OUT)
RX2_2: U18.C13(RX2) U25.2(RX_OUT)
RX2_3: U19.C13(RX2) U30.2(RX_OUT)
RX2_4: U20.C13(RX2) U34.2(RX_OUT)
RX3_1: GND.E1(RX3) U24.2(RX_OUT)
RX3_2: U18.E1(RX3) U27.2(RX_OUT)
RX3_3: U19.E1(RX3) U31.2(RX_OUT)
RX3_4: U20.E1(RX3) U35.2(RX_OUT)
RX4_1: GND.L1(RX4) U23.2(RX_OUT)
RX4_2: U18.L1(RX4) U28.2(RX_OUT)
RX4_3: U19.L1(RX4) U32.2(RX_OUT)
RX4_4: U20.L1(RX4) U36.2(RX_OUT)
SI5351_CLK6: C69.2 ; also sheet 2
STM32_MISO: U7.35(SDO) ; also sheet 2
STM32_MISO_1V8: GND.M4(SDO) U18.M4(SDO) U19.M4(SDO) U20.M4(SDO) ; also sheet 2
STM32_MOSI: U7.33(SDIO) ; also sheet 2
STM32_MOSI_1V8: GND.M5(SDIO) U18.M5(SDIO) U19.M5(SDIO) U20.M5(SDIO) ; also sheet 2
STM32_SCLK: U7.34(SCLK) ; also sheet 2
STM32_SCLK_1V8: GND.M6(SCLK) U18.M6(SCLK) U19.M6(SCLK) U20.M6(SCLK) ; also sheet 2
TR_SW_POS_1: GND.B5(TR_SW_POS) U21.20(CTRL_SW) U22.20(CTRL_SW) U23.20(CTRL_SW) U24.20(CTRL_SW)
TR_SW_POS_2: U18.B5(TR_SW_POS) U25.20(CTRL_SW) U26.20(CTRL_SW) U27.20(CTRL_SW) U28.20(CTRL_SW)
TR_SW_POS_3: U19.B5(TR_SW_POS) U29.20(CTRL_SW) U30.20(CTRL_SW) U31.20(CTRL_SW) U32.20(CTRL_SW)
TR_SW_POS_4: U20.B5(TR_SW_POS) U33.20(CTRL_SW) U34.20(CTRL_SW) U35.20(CTRL_SW) U36.20(CTRL_SW)
TX1_1: GND.L13(TX1) U22.5(TX_IN)
TX1_2: U18.L13(TX1) U26.5(TX_IN)
TX1_3: U19.L13(TX1) U29.5(TX_IN)
TX1_4: U20.L13(TX1) U33.5(TX_IN)
TX2_1: GND.E13(TX2) U21.5(TX_IN)
TX2_2: U18.E13(TX2) U25.5(TX_IN)
TX2_3: U19.E13(TX2) U30.5(TX_IN)
TX2_4: U20.E13(TX2) U34.5(TX_IN)
TX3_1: GND.C1(TX3) U24.5(TX_IN)
TX3_2: U18.C1(TX3) U27.5(TX_IN)
TX3_3: U19.C1(TX3) U31.5(TX_IN)
TX3_4: U20.C1(TX3) U35.5(TX_IN)
TX4_1: GND.J1(TX4) U23.5(TX_IN)
TX4_2: U18.J1(TX4) U28.5(TX_IN)
TX4_3: U19.J1(TX4) U32.5(TX_IN)
TX4_4: U20.J1(TX4) U36.5(TX_IN)
Unconnected: GND.A3(TR_SW_NEG) GND.B4(TR_POL) IC2.3(!SHDNA) IC2.4(!SHDNB) U7.38(SYNCP) U7.39(SYNCN) U11.4(NO_CONNECTION) U11.5(NO_CONNECTION_2) U11.8(NO_CONNECTION_3) U11.11(NO_CONNECTION_4) U11.12(NO_CONNECTION_5) U12.4(NO_CONNECTION) U12.5(NO_CONNECTION_2) U12.8(NO_CONNECTION_3) U12.11(NO_CONNECTION_4) U12.12(NO_CONNECTION_5) U18.A3(TR_SW_NEG) U18.B4(TR_POL) U19.A3(TR_SW_NEG) U19.B4(TR_POL) U20.A3(TR_SW_NEG) U20.B4(TR_POL)

### Notes on the sheet
- RADIO FREQUENCY

## Library data of the parts
C1 C2 C4-C14 C17-C35 C37-C123 C125-C159 C161-C165 C167 C176-C185 C188-C202 = eagle-ltspice:C: CAPACITOR, European symbol; SPICEMODEL: NONE; SPICEPREFIX: C
C3 C15 C16 C124 = SparkFun-Capacitors:10UF-POLAR: 10.0µF polarized capacitors A capacitor is a passive two-terminal electrical component used to store electrical energy temporarily in an electric field.; PROD_ID: CAP-13210; VALUE: 10uF
C36 = My_Library_RADAR:UCD1H101MNL1GS; COPYRIGHT: Copyright (C) 2025 Ultra Librarian. All rights reserved.; MANUFACTURER_PART_NUMBER: UCD1H101MNL1GS; MFR_NAME: Nichicon
C186 C187 = SparkFun-Capacitors:4.7UF-POLAR; PROD_ID: CAP-13916
D1-D5 = SparkFun-LED:LED-BLUE: Blue SMD LED Used in manufacturing of various products at SparkFun Packages: 0603 - SMD 0603 package [Product Link] <http://www.digikey.com/product-detail/en/SMLE12BC7TT86/511-1589-2-ND/1641808> 1206 - SMD1206 package [Product Link] <http://www.digikey.com/product-detail/en/lite-on-inc/LTST-C150TBKT/160-1643-1-ND/573584> SparkFun Products: ESP8266 Thing-Dev Board <https://www.sparkfun.com/products/13711> RedBoard <https://www.sparkfun.com/products/12757>; PROD_ID: DIO-08575
GND U18-U20 = My_Library_RADAR:ADAR1000ACCZN; COPYRIGHT: Copyright (C) 2024 Ultra Librarian. All rights reserved.; MANUFACTURER_PART_NUMBER: ADAR1000ACCZN; MFR_NAME: Analog Devices Inc; TYPE: RF
IC1 = atmel:AT93C46A-10?Q-2.7: Three-wire Automotive Temperature Serial EEPROM 1K (64 x 16) Source: http://www.atmel.com/dyn/resources/prod_documents/doc5089.pdf; MPN: AT93C46DN-SH-B; OC_FARNELL: 1455086; OC_NEWARK: 58M3879
IC2 = LTC6419IV#PBF:LTC6419IV#PBF: SP Amp DIFF AMP Dual 5.25V 20-Pin LGA Tray Source: Datasheet; DESCRIPTION: SP Amp DIFF AMP Dual 5.25V 20-Pin LGA Tray; HEIGHT: 0.84mm; MANUFACTURER_NAME: Analog Devices; MANUFACTURER_PART_NUMBER: LTC6419IV#PBF; MOUSER_PART_NUMBER: 584-LTC6419IVPBF; MOUSER_PRICE-STOCK: https://www.mouser.co.uk/ProductDetail/Analog-Devices/LTC6419IVPBF?qs=u4fy%2FsgLU9PcyTWj7PHUcg%3D%3D
J1-J16 = Eagle_WR-SMP_rev21a:60124102122403: WR-SMP Straight MATERIAL PROPERTIES Insulator Material LCP Center Contact Material Brass Center Contact Plating Gold, min. 0.127 μm over Nickel Body Material Brass Body Plating Gold, min. 0.127 μm over Nickel KIND PROPERTIES Interface MIL-STD-348 Connector Type SMP Gender Plug Orientation Type Straight GENERAL INFORMATION Operating Temperature -65 up to +165 °C ELECTRICAL PROPERTIES f DC~12 GHz MECHANICAL PROPERTIES Mating Cycle 500 Cycles; 1000 Cycles PACKAGING PROPERTIES Packaging Tray <https://www.we-online.com/catalog/media/o176648v209%20Family_WR-SMP_60114102122403.jpg> Details see: https://www.we-online.com/catalog/en/SMP_SMT_STRAIGHT/ Updated by Ella Wu 2020-05-29 2020(C) Würth Elektronik; DATASHEET-URL: https://www.we-online.com/catalog/datasheet/60124102122403.pdf; GENDER: Plug; INTERFACE: MIL-STD-348; MOUNT: SMT; ORIENTATION-TYPE: Straight; PART-NUMBER: 60124102122403; Z: 50Ohm
J17 = 691137910002:691137910002: Wurth Elektronik 1379, 2 Way PCB Terminal Block Source: Datasheet <http://katalog.we-online.de/em/datasheet/6911379100xx.pdf>; DESCRIPTION: Wurth Elektronik 1379, 2 Way PCB Terminal Block; HEIGHT: 11.6mm; MANUFACTURER_NAME: Wurth Elektronik; MANUFACTURER_PART_NUMBER: 691137910002; MOUSER_PART_NUMBER: 710-691137910002; MOUSER_PRICE-STOCK: https://www.mouser.co.uk/ProductDetail/Wurth-Elektronik/691137910002?qs=sPbYRqrBIVkdp9j8kfiV1w%3D%3D
JP2 = pinhead:PINHD-1X6: PIN HEADER
JP3 = pinhead:PINHD-2X4: PIN HEADER
JP4 = pinhead:PINHD-1X2: PIN HEADER
JP5 = pinhead:PINHD-1X4: PIN HEADER
L1-L4 L9-L15 L17 = SparkFun-Coils:2.2μH_SHIELDED_INDUCTOR: Murata 2.2uH Inductor 2.2uH 1.2A 110mOhm 0806 Package Shielded Bourns 2.2uH Inductor 2.2uH 5.5A 205mOhm 5x5mm Package Shielded; PROD_ID: NDUC-14257
L5-L7 L19 L20 = inductors:BLM15H: EMIFIL (R) Chip Ferrite Bead for GHz Noise Source: http://www.murata.com/ Ferrite Bead BLM15H.pdf
L8 L16 L18 L21-L27 = eagle-ltspice:L: INDUCTOR, European symbol; SPICEMODEL: NONE; SPICEPREFIX: L
R1-R125 R138-R159 R161 = eagle-ltspice:R: RESISTOR, European symbol; SPICEMODEL: NONE; SPICEPREFIX: R
S1 = SparkFun-Switches:MOMENTARY-SWITCH-SPST: Momentary Switch (Pushbutton) - SPST Normally-open (NO) SPST momentary switches (buttons, pushbuttons). Variants PTH-12MM - 12mm square, through-hole Momentary Pushbutton Switch - 12mm Square <https://www.sparkfun.com/products/9190> (COM-09190) PTH-6.0MM, PTH-6.0MM-KIT - 6.0mm square, through-hole Mini Pushbutton Switch <https://www.sparkfun.com/products/97> (COM-00097) KIT package intended for soldering kit's - only one side of pads' copper is exposed. PTH-RIGHT-ANGLE-KIT - Right-angle, through-hole Right Angle Tactile Button <https://www.sparkfun.com/products/10791> - Used on SparkFun BigTime Watch Kit <https://www.sparkfun.com/products/11734> SMD-12MM - 12mm square, surface-mount Tactile Button - SMD (12mm) <https://www.sparkfun.com/products/12993> (COM-12993) Used on SparkFun PicoBoard <https://www.sparkfun.com/products/11888> SMD-4.5MM - 4.5mm Square Trackball Switch Used on SparkFun Blackberry Trackballer Breakout <https://www.sparkfun.com/products/13169> SMD-4.6MMX2.8MM - 4.60mm x 2.80mm, surface mount Used on SparkFun Pro Micro - RP2040 <https://www.sparkfun.com/products/17717> SMD-5.2MM, SMD-5.2-REDUNDANT - 5.2mm square, surface-mount Mini Pushbutton Switch - SMD <https://www.sparkfun.com/products/8720> (COM-08720) Used on Arduino Pro Mini <https://www.sparkfun.com/products/11114> REDUNDANT package connects both switch circuits together SMD-6.0X3.5MM - 6.0 x 3.5mm, surface mount Momentary Reset Switch SMD <https://www.sparkfun.com/products/8229> (COM-08229) SMD-6.2MM-TALL - 6.2mm square, surface mount Tactile Button - SMD (6mm) <https://www.sparkfun.com/products/12992> Used on SparkFun Digital Sandbox <https://www.sparkfun.com/products/12651> SMD-RIGHT-ANGLE - Right-angle, surface mount Used on SparkFun Block for Intel® Edison - Arduino <https://www.sparkfun.com/products/13036>; PROD_ID: SWCH-15606
TP1-TP18 = SparkFun-Connectors:TEST-POINT: SparkFun Test Points Bare copper test points for troubleshooting or In-Circuit-Testing. These are used by our Production team for verifying production board runs using pogo-pins on test beds. SparkFun Products: SparkFun LSM9DS1 Breakout <https://www.sparkfun.com/products/13284> SparkFun PSOC <https://www.sparkfun.com/products/13714> SparkFun Load Cell Amplifier <https://www.sparkfun.com/products/13879>
U1 U38 U39 = My_Library:MAX20029ATIA/V+; COPYRIGHT: Copyright (C) 2024 Ultra Librarian. All rights reserved.; MANUFACTURER_PART_NUMBER: MAX20029ATIA/V+; MFR_NAME: Analog Devices Inc
U2 = My_Library:STM32F746ZGT7; COPYRIGHT: Copyright (C) 2024 Ultra Librarian. All rights reserved.; MANUFACTURER_PART_NUMBER: STM32F746ZGT7; MFR_NAME: STMicroelectronics
U3 = My_Library_2:AD9708AR; COPYRIGHT: Copyright (C) 2024 Ultra Librarian. All rights reserved.; MANUFACTURER_PART_NUMBER: AD9708AR; MFR_NAME: Analog Devices Inc
U4 = My_Library_RADAR:MAX1449EHJ+; COPYRIGHT: Copyright (C) 2024 Ultra Librarian. All rights reserved.; MANUFACTURER_PART_NUMBER: MAX1449EHJ+; MFR_NAME: Analog Devices Inc
U5 U13 = My_Library_RADAR:LTC5552IUDBTRMPBF; COPYRIGHT: Copyright (C) 2024 Ultra Librarian. All rights reserved.; MANUFACTURER_PART_NUMBER: LTC5552IUDB#TRMPBF; MFR_NAME: Analog Devices Inc
U6 = My_Library_RADAR:FT2232HQ; COPYRIGHT: Copyright (C) 2025 Ultra Librarian. All rights reserved.; MANUFACTURER_PART_NUMBER: FT2232HQ; MFR_NAME: FTDI, Future Technology Devices International Ltd
U7 = My_Library_RADAR:ADF4382ABCCZ; COPYRIGHT: Copyright (C) 2024 Ultra Librarian. All rights reserved.; MANUFACTURER_PART_NUMBER: ADF4382ABCCZ; MFR_NAME: Analog Devices Inc
U8 U37 = My_Library:LM2662MX/NOPB; COPYRIGHT: Copyright (C) 2024 Ultra Librarian. All rights reserved.; MANUFACTURER_PART_NUMBER: LM2662MX/NOPB; MFR_NAME: Texas Instruments; TYPE: LM2662M
U9 = My_Library:MT25QL01GBBB8E12-0AUT; COPYRIGHT: Copyright (C) 2024 Ultra Librarian. All rights reserved.; MANUFACTURER_PART_NUMBER: MT25QL01GBBB8E12-0AUT; MFR_NAME: Micron
U10 = My_Library:SI5351A-B-GM; COPYRIGHT: Copyright (C) 2024 Ultra Librarian. All rights reserved.; MANUFACTURER_PART_NUMBER: SI5351A-B-GM; MFR_NAME: Silicon Labs
U11 U12 = My_Library_RADAR:MTX2-143+; COPYRIGHT: Copyright (C) 2024 Ultra Librarian. All rights reserved.; MANUFACTURER_PART_NUMBER: MTX2-143+; MFR_NAME: Mini Circuits
U14 U15 = My_Library_RADAR:SZMMSZ5232BT1G; COPYRIGHT: Copyright (C) 2024 Ultra Librarian. All rights reserved.; MANUFACTURER_PART_NUMBER: SZMMSZ5232BT1G; MFR_NAME: onsemi
U16 = My_Library_RADAR:EP4RKU+; COPYRIGHT: Copyright (C) 2024 Ultra Librarian. All rights reserved.; MANUFACTURER_PART_NUMBER: EP4RKU+; MFR_NAME: Mini Circuits
U21-U36 = My_Library_RADAR:ADTR1107ACCZ; COPYRIGHT: Copyright (C) 2024 Ultra Librarian. All rights reserved.; MANUFACTURER_PART_NUMBER: ADTR1107ACCZ; MFR_NAME: Analog Devices Inc; TYPE: RF
U42 = XC7A50T-2FTG256I:XC7A50T-2FTG256I: Artix-7 Field Programmable Gate Array (FPGA) IC 170 2764800 52160 256-LBGA Check availability <https://pricing.snapeda.com/parts/XC7A50T-2FTG256I/Xilinx%20Inc./view-part?ref=eda>; AVAILABILITY: In Stock; CHECK_PRICES: https://www.snapeda.com/parts/XC7A50T-2FTG256I/Xilinx/view-part/?ref=eda; DESCRIPTION: Artix-7 Field Programmable Gate Array (FPGA) IC 170 2764800 52160 256-LBGA; MF: Xilinx Inc.; MP: XC7A50T-2FTG256I; PACKAGE: LBGA-256 Xilinx Inc.; PRICE: None; SNAPEDA_LINK: https://www.snapeda.com/parts/XC7A50T-2FTG256I/Xilinx/view-part/?ref=snap
U$1 = My_Library_RADAR:M3SWA2-34DR+
U$2 U$3 = My_Library_RADAR:BPF2
X2 = con-cypressindustries:MINI-USB-: MINI USB-B Conector Source: www.cypressindustries.com; OC_FARNELL: unknown; OC_NEWARK: unknown
XTAL1 XTAL3 = My_Library:NX3225GD-8MHZ-STD-CRA-3; COPYRIGHT: Copyright (C) 2024 Ultra Librarian. All rights reserved.; MANUFACTURER_PART_NUMBER: NX3225GD-8MHZ-STD-CRA-3; MFR_NAME: NDK
XTAL4 = My_Library:CX3225SB25000D0FLJZ1; COPYRIGHT: Copyright (C) 2024 Ultra Librarian. All rights reserved.; MANUFACTURER_PART_NUMBER: CX3225SB25000D0FLJZ1; MFR_NAME: KYOCERA AVX
Y1 = SparkFun-Clocks:CRYSTAL-12MHZ: 12.0MHz Crystal Frequency: 12.0MHz Frequency Tolerance: ±20ppm Load Capacitance: 18pF SparkFun Products: SparkFun Logomatic <https://www.sparkfun.com/products/12772> Pocket AVR Programmer <https://www.sparkfun.com/products/9825>; PROD_ID: XTAL-15540